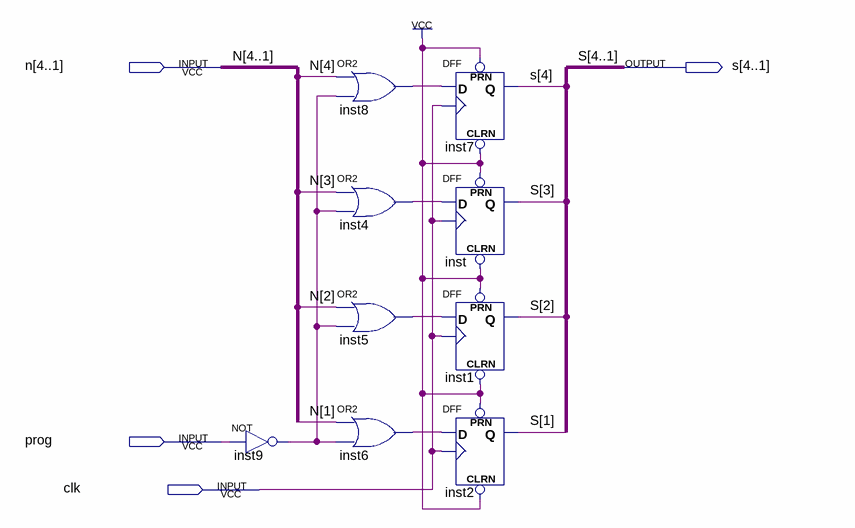
[diagram p0: schematic sheet]
// Quartus schematic controller_state.bdf as structural Verilog: 9 symbols, 4 pins
module controller_state (
  input  [4:1] n,
  input  prog,
  input  clk,
  output [4:1] s
);

  wire inst4_out, inst5_out, inst6_out, inst8_out, inst9_out;

  not inst9 (inst9_out, prog);
  or inst8 (inst8_out, n[4], inst9_out);
  or inst4 (inst4_out, n[3], inst9_out);
  or inst5 (inst5_out, n[2], inst9_out);
  or inst6 (inst6_out, n[1], inst9_out);
  DFF inst7 (.CLRN(1'b1), .CLK(clk), .D(inst8_out), .PRN(1'b1), .Q(s[4]));
  DFF inst (.CLRN(1'b1), .CLK(clk), .D(inst4_out), .PRN(1'b1), .Q(s[3]));
  DFF inst1 (.CLRN(1'b1), .CLK(clk), .D(inst5_out), .PRN(1'b1), .Q(s[2]));
  DFF inst2 (.CLRN(1'b1), .CLK(clk), .D(inst6_out), .PRN(1'b1), .Q(s[1]));
endmodule
